# Altium schematic sheet slave-14-mc33775.SchDoc
size A3; DocumentNumber: 1; SheetNumber: 1; SheetTotal: 11; SheetDescription: Overview
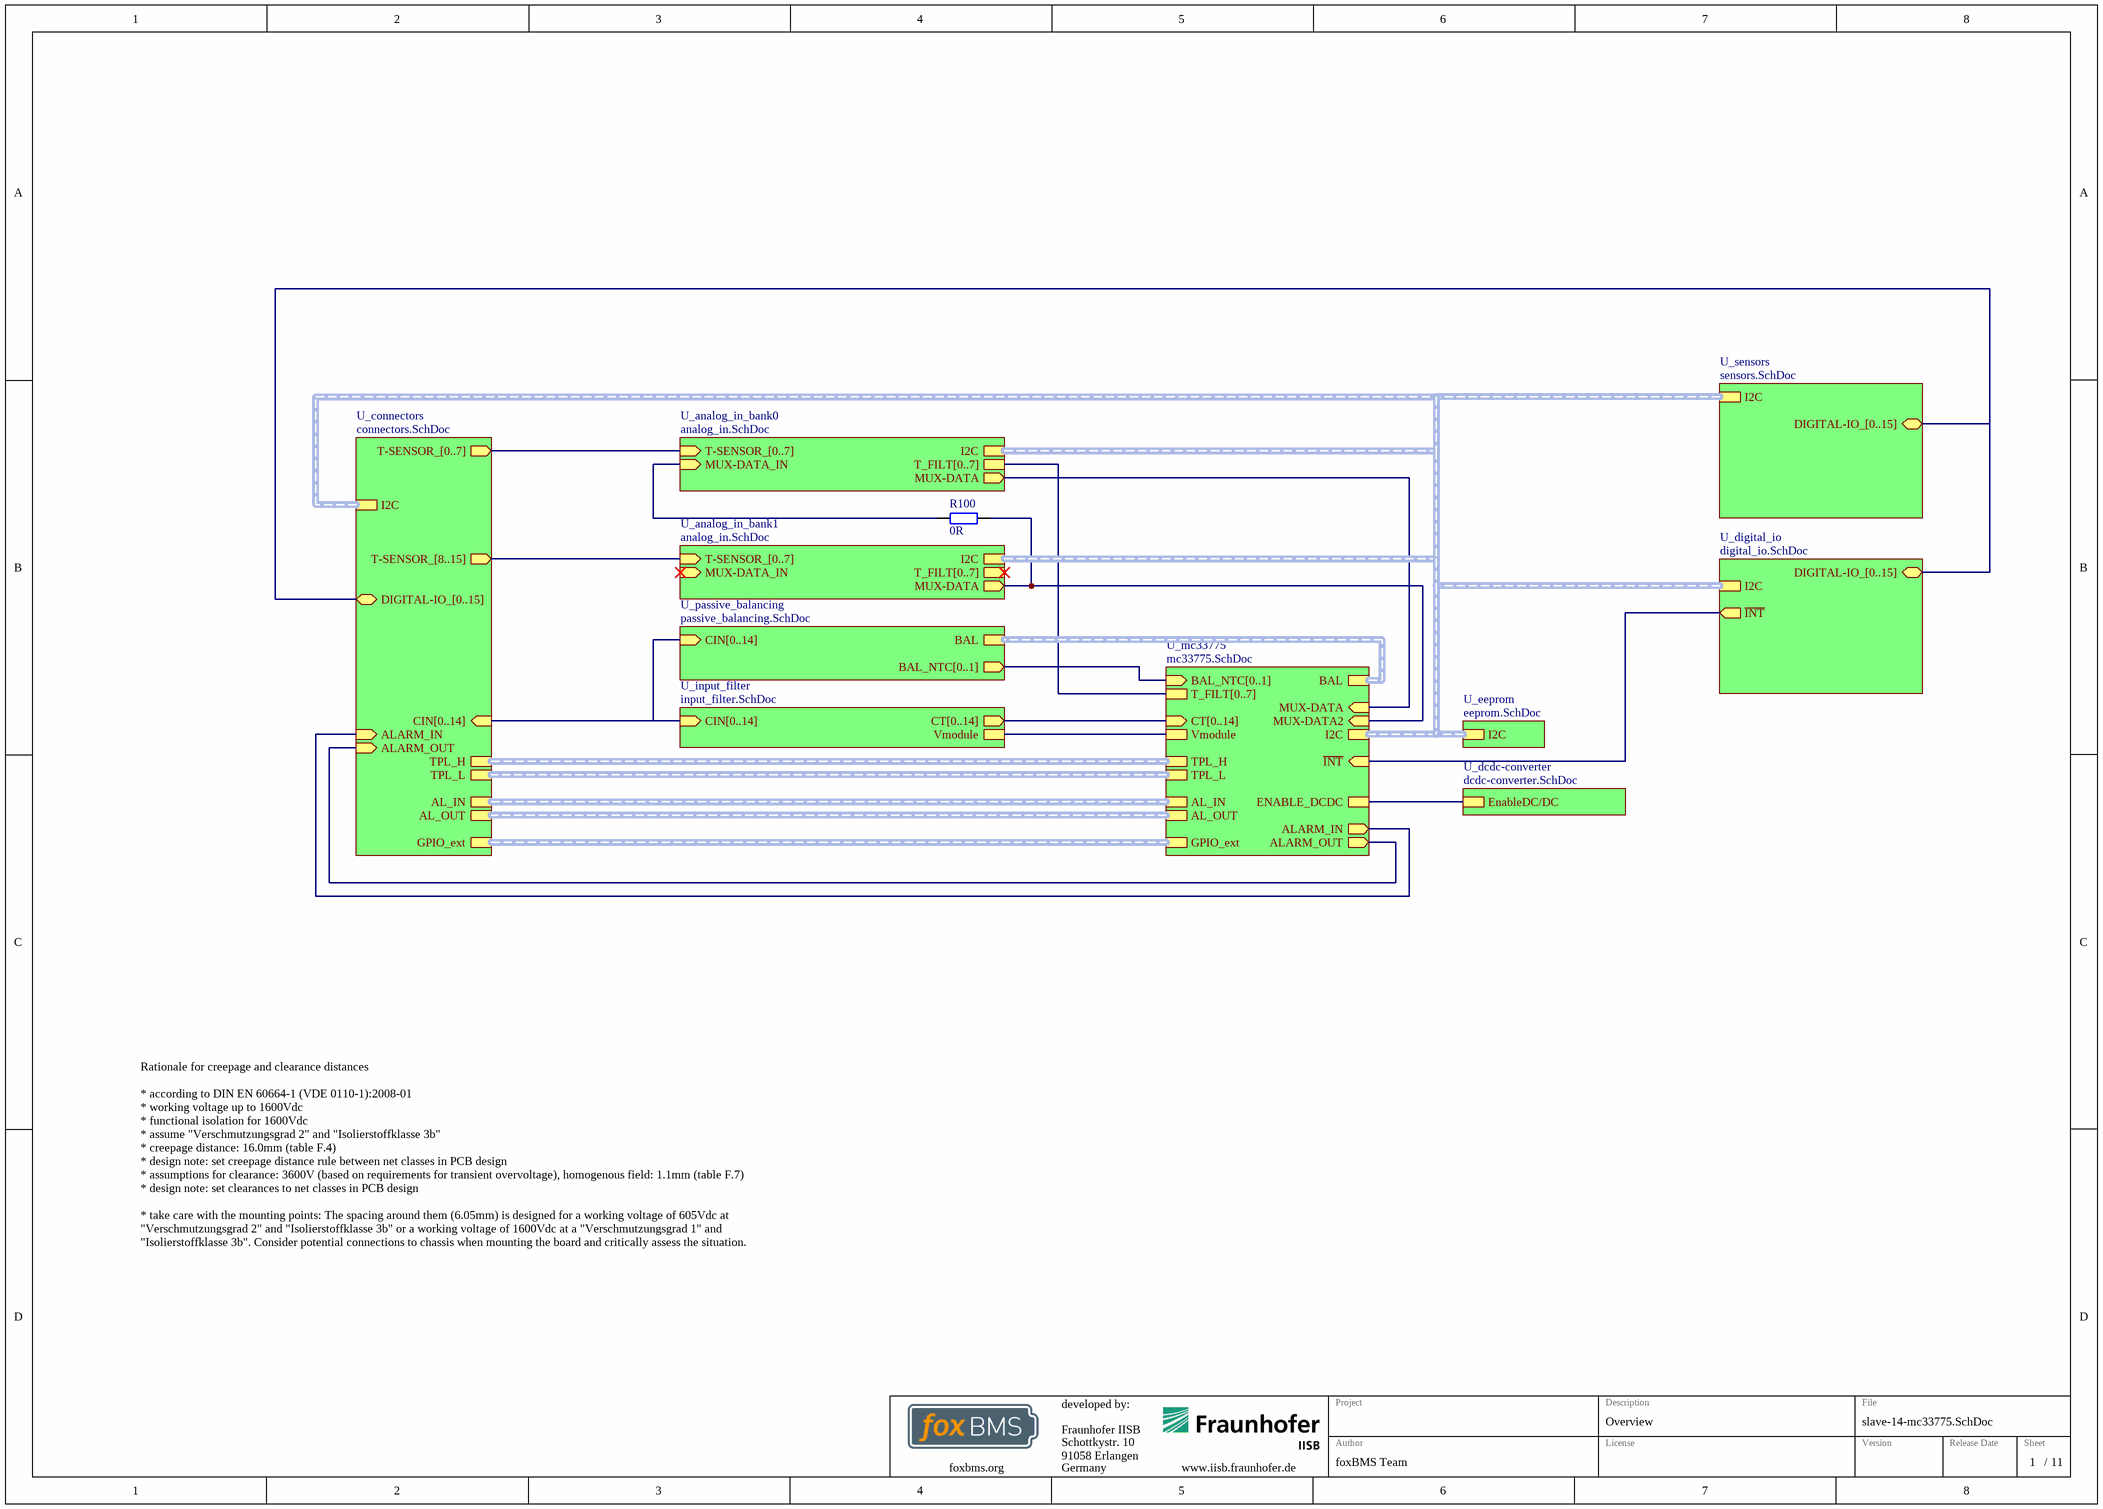
[diagram p0: slave-14-mc33775.SchDoc]

## Parts
R100  0R  [RESC1608X05N]

## Sub-sheets
U_analog_in_bank0 = analog_in.SchDoc: MUX-DATA (out), T-SENSOR_[0..7] (in), I2C (harness I2C), MUX-DATA_IN (in), T_FILT[0..7]
U_analog_in_bank1 = analog_in.SchDoc: MUX-DATA (out), T-SENSOR_[0..7] (in), I2C (harness I2C), MUX-DATA_IN (in), T_FILT[0..7]
U_connectors = connectors.SchDoc: T-SENSOR_[0..7] (out), CIN[0..14] (in), TPL_L (harness TPL), TPL_H (harness TPL), AL_OUT (harness ALARM), AL_IN (harness ALARM), GPIO_ext (harness GPIO_ext), T-SENSOR_[8..15] (out), DIGITAL-IO_[0..15] (bidir), ALARM_IN (in), ALARM_OUT (in), I2C (harness I2C)
U_dcdc-converter = dcdc-converter.SchDoc: EnableDC/DC
U_digital_io = digital_io.SchDoc: DIGITAL-IO_[0..15] (bidir), ~{INT} (out), I2C (harness I2C)
U_eeprom = eeprom.SchDoc: I2C (harness I2C)
U_input_filter = input_filter.SchDoc: CT[0..14] (out), CIN[0..14] (in), Vmodule
U_mc33775 = mc33775.SchDoc: I2C (harness I2C), CT[0..14] (in), BAL (harness BAL), AL_IN (harness ALARM), AL_OUT (harness ALARM), BAL_NTC[0..1] (in), MUX-DATA (in), TPL_L (harness TPL), TPL_H (harness TPL), GPIO_ext (harness GPIO_ext), MUX-DATA2 (in), ~{INT} (in), T_FILT[0..7], ENABLE_DCDC, ALARM_IN (out), ALARM_OUT (out), Vmodule
U_passive_balancing = passive_balancing.SchDoc: CIN[0..14] (in), BAL (harness BAL), BAL_NTC[0..1] (out)
U_sensors = sensors.SchDoc: DIGITAL-IO_[0..15] (bidir), I2C (harness I2C)

## Nets
NetR100_1: R100.1 ; sheet U_analog_in_bank0/MUX-DATA_IN
NetR100_2: R100.2 ; sheet U_mc33775/MUX-DATA2, sheet U_analog_in_bank1/MUX-DATA
(unnamed): sheet U_mc33775/MUX-DATA, sheet U_analog_in_bank0/MUX-DATA
(unnamed): sheet U_mc33775/~{INT}, sheet U_digital_io/~{INT}
(unnamed): sheet U_mc33775/ENABLE_DCDC, sheet U_dcdc-converter/EnableDC/DC
(unnamed): sheet U_mc33775/ALARM_IN, sheet U_connectors/ALARM_IN
(unnamed): sheet U_mc33775/ALARM_OUT, sheet U_connectors/ALARM_OUT
(unnamed): sheet U_mc33775/Vmodule, sheet U_input_filter/Vmodule

## Buses and harness runs
bus sheet U_analog_in_bank0/T-SENSOR_[0..7] = sheet U_connectors/T-SENSOR_[0..7]
bus sheet U_analog_in_bank0/T_FILT[0..7] = sheet U_mc33775/T_FILT[0..7]
bus sheet U_analog_in_bank1/T-SENSOR_[0..7] = sheet U_connectors/T-SENSOR_[8..15]
bus sheet U_connectors/CIN[0..14] = sheet U_input_filter/CIN[0..14] = sheet U_passive_balancing/CIN[0..14]
bus sheet U_connectors/DIGITAL-IO_[0..15] = sheet U_digital_io/DIGITAL-IO_[0..15] = sheet U_sensors/DIGITAL-IO_[0..15]
bus sheet U_input_filter/CT[0..14] = sheet U_mc33775/CT[0..14]
bus sheet U_mc33775/BAL_NTC[0..1] = sheet U_passive_balancing/BAL_NTC[0..1]
harness sheet U_analog_in_bank0/I2C = sheet U_analog_in_bank1/I2C = sheet U_connectors/I2C = sheet U_digital_io/I2C = sheet U_eeprom/I2C = sheet U_mc33775/I2C = sheet U_sensors/I2C
harness sheet U_connectors/AL_IN = sheet U_mc33775/AL_IN
harness sheet U_connectors/AL_OUT = sheet U_mc33775/AL_OUT
harness sheet U_connectors/GPIO_ext = sheet U_mc33775/GPIO_ext
harness sheet U_connectors/TPL_H = sheet U_mc33775/TPL_H
harness sheet U_connectors/TPL_L = sheet U_mc33775/TPL_L
harness sheet U_mc33775/BAL = sheet U_passive_balancing/BAL

## Notes on the sheet
- Rationale for creepage and clearance distances
  * according to DIN EN 60664-1 (VDE 0110-1):2008-01
  * working voltage up to 1600Vdc
  * functional isolation for 1600Vdc
  * assume "Verschmutzungsgrad 2" and "Isolierstoffklasse 3b"
  * creepage distance: 16.0mm (table F.4)
  * design note: set creepage distance rule between net classes in PCB design
  * assumptions for clearance: 3600V (based on requirements for transient overvoltage), homogenous field: 1.1mm (table F.7)
  * design note: set clearances to net classes in PCB design
  * take care with the mounting points: The spacing around them (6.05mm) is designed for a working voltage of 605Vdc at "Verschmutzungsgrad 2" and "Isolierstoffklasse 3b" or a working voltage of 1600Vdc at a "Verschmutzungsgrad 1" and "Isolierstoffklasse 3b". Consider potential connections to chassis when mounting the board and critically assess the situation.
- Fraunhofer IISB
- Schottkystr. 10
- developed by:
- 91058 Erlangen
- Germany
- Author
- Project
- License
- Description
- File
- Version
- Release Date
- Sheet
- foxbms.org <https://foxbms.org>
- www.iisb.fraunhofer.de <https://www.iisb.fraunhofer.de/>
- foxBMS Team
- /

## Library data of the parts
R100 = gen_R_0R_0603: SMD Resistor 0R 0603; Power: 0.1W; Case EIA: 0603; Case Metric: 1608; Maximum Working Voltage: 75V; PnP Package: 0603R; Automotive Qualified: True; PnP equipped: x; Part Number: gen_R_0R_0603; Operating Temperature: -55°C - +155°C; Resistance: 0R; Series: Jumper; PnP Value: 0R; Supplier 1: Farnell; Supplier Part Number 1: 2616580